# Altium schematic sheet OpenPack_BATMOD_V1p0_MECH.SchDoc
size A4; SheetNumber: 10; SheetTotal: 10; Title_: Mechanical
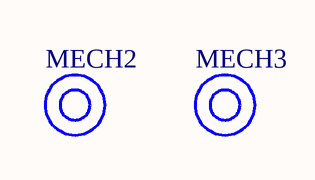
[diagram p0: OpenPack_BATMOD_V1p0_MECH.SchDoc]

## Parts
MECH2  Fiducial  [FIDU_1MM]  (value not drawn)  (no BOM)
MECH3  Fiducial  [FIDU_1MM]  (value not drawn)  (no BOM)

## Notes on the sheet
- Board:
- Author:
- Title:
- Project:
- SVN:
- Version:
- Sheet:
- of
- Contact:
- Modified:
- Size:
- A4

## Library data of the parts
MECH2 MECH3 = FIDU: Fiducatial, round, 1mm